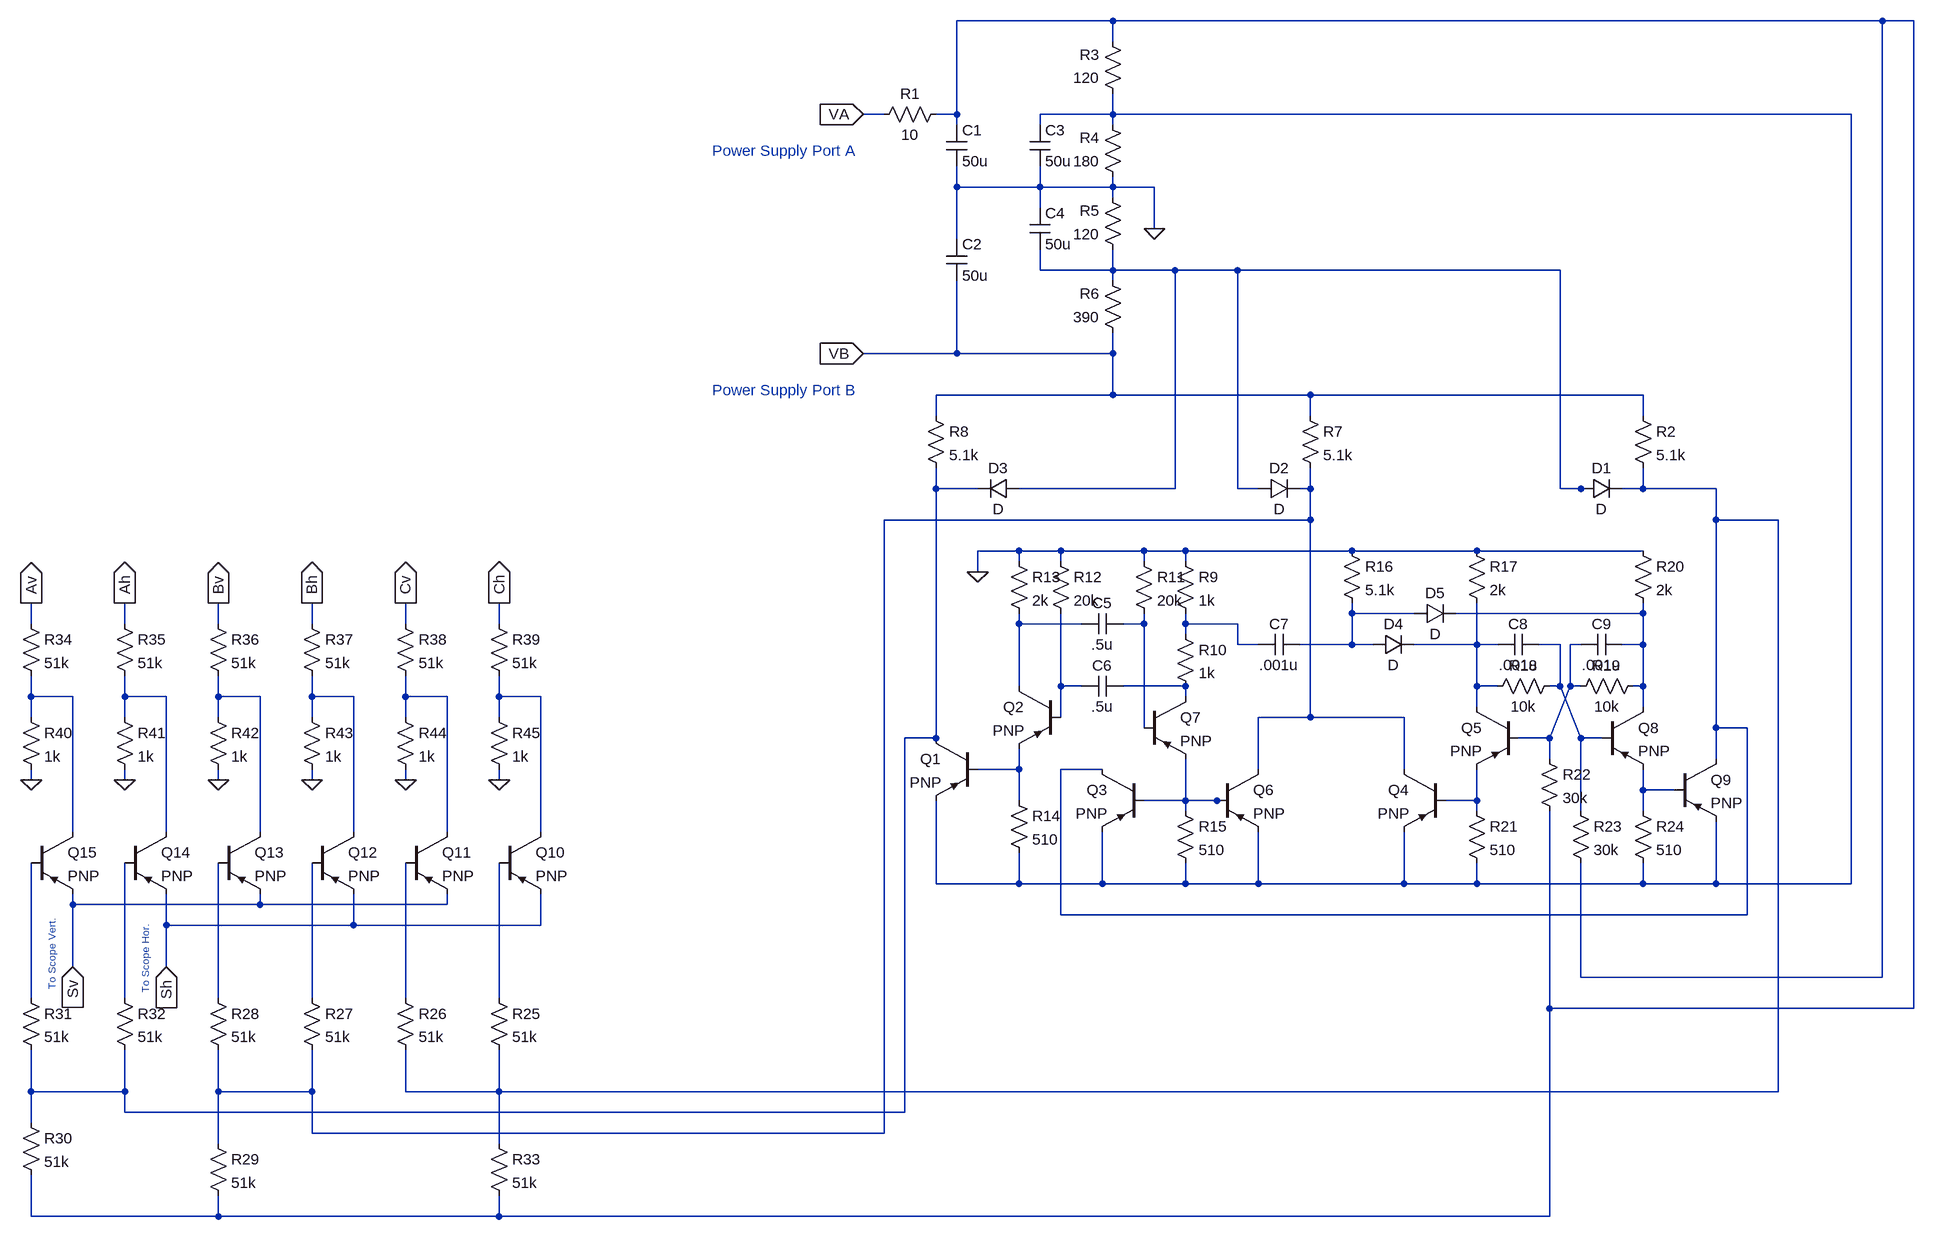
[diagram p0: schematic T42 SwitchCircuit.asc]
T42 SwitchCircuit.asc, the LTspice schematic file:
Version 4
SHEET 1 1700 1368
WIRE 464 -480 224 -480
WIRE 1648 -480 464 -480
WIRE 1696 -480 1648 -480
WIRE 464 -448 464 -480
WIRE 112 -336 80 -336
WIRE 224 -336 224 -480
WIRE 224 -336 192 -336
WIRE 464 -336 464 -368
WIRE 464 -336 352 -336
WIRE 1600 -336 464 -336
WIRE 224 -320 224 -336
WIRE 352 -320 352 -336
WIRE 464 -320 464 -336
WIRE 224 -224 224 -256
WIRE 352 -224 352 -256
WIRE 352 -224 224 -224
WIRE 464 -224 464 -240
WIRE 464 -224 352 -224
WIRE 528 -224 464 -224
WIRE 464 -208 464 -224
WIRE 352 -192 352 -224
WIRE 528 -160 528 -224
WIRE 224 -144 224 -224
WIRE 352 -96 352 -128
WIRE 464 -96 464 -128
WIRE 464 -96 352 -96
WIRE 560 -96 464 -96
WIRE 656 -96 560 -96
WIRE 1152 -96 656 -96
WIRE 464 -80 464 -96
WIRE 224 32 224 -80
WIRE 224 32 80 32
WIRE 464 32 464 0
WIRE 464 32 224 32
WIRE 464 96 464 32
WIRE 464 96 192 96
WIRE 768 96 464 96
WIRE 1280 96 768 96
WIRE 192 128 192 96
WIRE 768 128 768 96
WIRE 1280 128 1280 96
WIRE 192 240 192 208
WIRE 256 240 192 240
WIRE 560 240 560 -96
WIRE 560 240 320 240
WIRE 656 240 656 -96
WIRE 688 240 656 240
WIRE 768 240 768 208
WIRE 768 240 752 240
WIRE 1152 240 1152 -96
WIRE 1184 240 1152 240
WIRE 1200 240 1184 240
WIRE 1280 240 1280 208
WIRE 1280 240 1248 240
WIRE 1392 240 1280 240
WIRE 768 288 768 240
WIRE 768 288 112 288
WIRE 1392 288 1392 240
WIRE 1488 288 1392 288
WIRE 320 336 256 336
WIRE 384 336 320 336
WIRE 512 336 384 336
WIRE 576 336 512 336
WIRE 832 336 576 336
WIRE 1024 336 832 336
WIRE 1280 336 1024 336
WIRE 320 352 320 336
WIRE 384 352 384 336
WIRE 512 352 512 336
WIRE 576 352 576 336
WIRE 256 368 256 336
WIRE 832 432 832 416
WIRE 928 432 832 432
WIRE 1280 432 1280 416
WIRE 1280 432 992 432
WIRE -1200 448 -1200 416
WIRE -1056 448 -1056 416
WIRE -912 448 -912 416
WIRE -768 448 -768 416
WIRE -624 448 -624 416
WIRE -480 448 -480 416
WIRE 320 448 320 432
WIRE 416 448 320 448
WIRE 512 448 512 432
WIRE 512 448 480 448
WIRE 576 448 576 432
WIRE 656 448 576 448
WIRE 576 464 576 448
WIRE 656 480 656 448
WIRE 688 480 656 480
WIRE 832 480 832 432
WIRE 832 480 752 480
WIRE 864 480 832 480
WIRE 1024 480 1024 416
WIRE 1024 480 928 480
WIRE 1056 480 1024 480
WIRE 1152 480 1120 480
WIRE 1184 480 1168 480
WIRE 1280 480 1280 432
WIRE 1280 480 1248 480
WIRE 320 544 320 448
WIRE 384 544 384 432
WIRE 416 544 384 544
WIRE 576 544 480 544
WIRE 1024 544 1024 480
WIRE 1056 544 1024 544
WIRE 1152 544 1152 480
WIRE 1152 544 1136 544
WIRE 1168 544 1168 480
WIRE 1184 544 1168 544
WIRE 1280 544 1280 480
WIRE 1280 544 1264 544
WIRE -1200 560 -1200 528
WIRE -1136 560 -1200 560
WIRE -1056 560 -1056 528
WIRE -992 560 -1056 560
WIRE -912 560 -912 528
WIRE -848 560 -912 560
WIRE -768 560 -768 528
WIRE -704 560 -768 560
WIRE -624 560 -624 528
WIRE -560 560 -624 560
WIRE -480 560 -480 528
WIRE -416 560 -480 560
WIRE 576 560 576 544
WIRE 1024 576 1024 544
WIRE 1280 576 1280 544
WIRE -1200 592 -1200 560
WIRE -1056 592 -1056 560
WIRE -912 592 -912 560
WIRE -768 592 -768 560
WIRE -624 592 -624 560
WIRE -480 592 -480 560
WIRE 384 592 384 544
WIRE 768 592 768 288
WIRE 768 592 688 592
WIRE 912 592 768 592
WIRE 512 608 512 448
WIRE 1392 608 1392 288
WIRE 1440 608 1392 608
WIRE 192 624 192 240
WIRE 192 624 144 624
WIRE 1136 624 1168 544
WIRE 1136 624 1088 624
WIRE 1184 624 1152 544
WIRE 1216 624 1184 624
WIRE 1136 656 1136 624
WIRE 1392 656 1392 608
WIRE 320 672 320 640
WIRE 320 672 256 672
WIRE 448 672 384 672
WIRE 688 672 688 592
WIRE 912 672 912 592
WIRE -1200 688 -1200 672
WIRE -1056 688 -1056 672
WIRE -912 688 -912 672
WIRE -768 688 -768 672
WIRE -624 688 -624 672
WIRE -480 688 -480 672
WIRE 1280 704 1280 672
WIRE 1328 704 1280 704
WIRE 320 720 320 672
WIRE 576 720 576 656
WIRE 576 720 512 720
WIRE 624 720 576 720
WIRE 640 720 624 720
WIRE 1024 720 1024 672
WIRE 1024 720 976 720
WIRE 576 736 576 720
WIRE 1024 736 1024 720
WIRE 1184 736 1184 624
WIRE 1280 736 1280 704
WIRE -1136 768 -1136 560
WIRE -992 768 -992 560
WIRE -848 768 -848 560
WIRE -704 768 -704 560
WIRE -560 768 -560 560
WIRE -416 768 -416 560
WIRE 192 848 192 720
WIRE 320 848 320 800
WIRE 320 848 192 848
WIRE 448 848 448 768
WIRE 448 848 320 848
WIRE 576 848 576 816
WIRE 576 848 448 848
WIRE 688 848 688 768
WIRE 688 848 576 848
WIRE 912 848 912 768
WIRE 912 848 688 848
WIRE 1024 848 1024 816
WIRE 1024 848 912 848
WIRE 1280 848 1280 816
WIRE 1280 848 1024 848
WIRE 1392 848 1392 752
WIRE 1392 848 1280 848
WIRE 1600 848 1600 -336
WIRE 1600 848 1392 848
WIRE -1136 880 -1136 864
WIRE -848 880 -848 864
WIRE -848 880 -1136 880
WIRE -560 880 -560 864
WIRE -560 880 -848 880
WIRE 384 896 384 672
WIRE 1440 896 1440 608
WIRE 1440 896 384 896
WIRE -992 912 -992 864
WIRE -704 912 -704 864
WIRE -704 912 -992 912
WIRE -416 912 -416 864
WIRE -416 912 -704 912
WIRE -1136 976 -1136 880
WIRE -992 976 -992 912
WIRE 1184 992 1184 816
WIRE 1648 992 1648 -480
WIRE 1648 992 1184 992
WIRE -1200 1024 -1200 816
WIRE -1056 1024 -1056 816
WIRE -912 1024 -912 816
WIRE -768 1024 -768 816
WIRE -624 1024 -624 816
WIRE -480 1024 -480 816
WIRE 1136 1040 1136 736
WIRE 1696 1040 1696 -480
WIRE 1696 1040 1136 1040
WIRE -1200 1168 -1200 1104
WIRE -1056 1168 -1056 1104
WIRE -1056 1168 -1200 1168
WIRE -912 1168 -912 1104
WIRE -768 1168 -768 1104
WIRE -768 1168 -912 1168
WIRE -624 1168 -624 1104
WIRE -480 1168 -480 1104
WIRE -480 1168 -624 1168
WIRE 1488 1168 1488 288
WIRE 1488 1168 -480 1168
WIRE -1056 1200 -1056 1168
WIRE 144 1200 144 624
WIRE 144 1200 -1056 1200
WIRE -1200 1216 -1200 1168
WIRE -768 1232 -768 1168
WIRE 112 1232 112 288
WIRE 112 1232 -768 1232
WIRE -912 1248 -912 1168
WIRE -480 1248 -480 1168
WIRE -1200 1360 -1200 1296
WIRE -912 1360 -912 1328
WIRE -912 1360 -1200 1360
WIRE -480 1360 -480 1328
WIRE -480 1360 -912 1360
WIRE 1136 1360 1136 1040
WIRE 1136 1360 -480 1360
FLAG 528 -160 0
FLAG 256 368 0
FLAG -1200 688 0
FLAG -1056 688 0
FLAG -912 688 0
FLAG -768 688 0
FLAG -624 688 0
FLAG -480 688 0
FLAG -1200 416 Av
IOPIN -1200 416 Out
FLAG -1056 416 Ah
IOPIN -1056 416 Out
FLAG -912 416 Bv
IOPIN -912 416 Out
FLAG -768 416 Bh
IOPIN -768 416 Out
FLAG -624 416 Cv
IOPIN -624 416 Out
FLAG -480 416 Ch
IOPIN -480 416 Out
FLAG -1136 976 Sv
IOPIN -1136 976 In
FLAG -992 976 Sh
IOPIN -992 976 In
FLAG 80 -336 VA
IOPIN 80 -336 In
FLAG 80 32 VB
IOPIN 80 32 In
SYMBOL res 208 -352 R90
WINDOW 0 0 56 VBottom 2
WINDOW 3 32 56 VTop 2
SYMATTR InstName R1
SYMATTR Value 10
SYMBOL cap 208 -320 R0
SYMATTR InstName C1
SYMATTR Value 50u
SYMBOL cap 208 -144 R0
SYMATTR InstName C2
SYMATTR Value 50u
SYMBOL diode 1184 256 R270
WINDOW 0 32 32 VTop 2
WINDOW 3 0 32 VBottom 2
SYMATTR InstName D1
SYMBOL res 1264 112 R0
SYMATTR InstName R2
SYMATTR Value 5.1k
SYMBOL res 480 -352 R180
WINDOW 0 36 76 Left 2
WINDOW 3 36 40 Left 2
SYMATTR InstName R3
SYMATTR Value 120
SYMBOL res 480 -224 R180
WINDOW 0 36 76 Left 2
WINDOW 3 36 40 Left 2
SYMATTR InstName R4
SYMATTR Value 180
SYMBOL res 480 -112 R180
WINDOW 0 36 76 Left 2
WINDOW 3 36 40 Left 2
SYMATTR InstName R5
SYMATTR Value 120
SYMBOL res 480 16 R180
WINDOW 0 36 76 Left 2
WINDOW 3 36 40 Left 2
SYMATTR InstName R6
SYMATTR Value 390
SYMBOL cap 336 -320 R0
SYMATTR InstName C3
SYMATTR Value 50u
SYMBOL cap 336 -192 R0
SYMATTR InstName C4
SYMATTR Value 50u
SYMBOL res 752 112 R0
SYMATTR InstName R7
SYMATTR Value 5.1k
SYMBOL diode 688 256 R270
WINDOW 0 32 32 VTop 2
WINDOW 3 0 32 VBottom 2
SYMATTR InstName D2
SYMBOL diode 320 224 R90
WINDOW 0 0 32 VBottom 2
WINDOW 3 32 32 VTop 2
SYMATTR InstName D3
SYMBOL res 176 112 R0
SYMATTR InstName R8
SYMATTR Value 5.1k
SYMBOL pnp 256 624 M0
SYMATTR InstName Q1
SYMBOL pnp 384 544 M0
SYMATTR InstName Q2
SYMBOL pnp 512 672 M0
SYMATTR InstName Q3
SYMBOL pnp 976 672 M0
SYMATTR InstName Q4
SYMBOL pnp 1088 576 M0
SYMATTR InstName Q5
SYMBOL res 560 336 R0
SYMATTR InstName R9
SYMATTR Value 1k
SYMBOL res 560 448 R0
SYMATTR InstName R10
SYMATTR Value 1k
SYMBOL res 496 336 R0
SYMATTR InstName R11
SYMATTR Value 20k
SYMBOL res 368 336 R0
SYMATTR InstName R12
SYMATTR Value 20k
SYMBOL res 304 336 R0
SYMATTR InstName R13
SYMATTR Value 2k
SYMBOL res 304 704 R0
SYMATTR InstName R14
SYMATTR Value 510
SYMBOL res 560 720 R0
SYMATTR InstName R15
SYMATTR Value 510
SYMBOL cap 480 432 R90
WINDOW 0 0 32 VBottom 2
WINDOW 3 32 32 VTop 2
SYMATTR InstName C5
SYMATTR Value .5u
SYMBOL cap 480 528 R90
WINDOW 0 0 32 VBottom 2
WINDOW 3 32 32 VTop 2
SYMATTR InstName C6
SYMATTR Value .5u
SYMBOL cap 752 464 R90
WINDOW 0 0 32 VBottom 2
WINDOW 3 32 32 VTop 2
SYMATTR InstName C7
SYMATTR Value .001u
SYMBOL diode 864 496 R270
WINDOW 0 32 32 VTop 2
WINDOW 3 0 32 VBottom 2
SYMATTR InstName D4
SYMBOL diode 928 448 R270
WINDOW 0 32 32 VTop 2
WINDOW 3 0 32 VBottom 2
SYMATTR InstName D5
SYMBOL res 816 320 R0
SYMATTR InstName R16
SYMATTR Value 5.1k
SYMBOL res 1008 320 R0
SYMATTR InstName R17
SYMATTR Value 2k
SYMBOL cap 1120 464 R90
WINDOW 0 0 32 VBottom 2
WINDOW 3 32 32 VTop 2
SYMATTR InstName C8
SYMATTR Value .001u
SYMBOL cap 1248 464 R90
WINDOW 0 0 32 VBottom 2
WINDOW 3 32 32 VTop 2
SYMATTR InstName C9
SYMATTR Value .001u
SYMBOL res 1152 528 R90
WINDOW 0 0 56 VBottom 2
WINDOW 3 32 56 VTop 2
SYMATTR InstName R18
SYMATTR Value 10k
SYMBOL res 1280 528 R90
WINDOW 0 0 56 VBottom 2
WINDOW 3 32 56 VTop 2
SYMATTR InstName R19
SYMATTR Value 10k
SYMBOL res 1264 320 R0
SYMATTR InstName R20
SYMATTR Value 2k
SYMBOL pnp 624 672 R0
SYMATTR InstName Q6
SYMBOL pnp 512 560 R0
SYMATTR InstName Q7
SYMBOL res 1008 720 R0
SYMATTR InstName R21
SYMATTR Value 510
SYMBOL res 1120 640 R0
SYMATTR InstName R22
SYMATTR Value 30k
SYMBOL res 1168 720 R0
SYMATTR InstName R23
SYMATTR Value 30k
SYMBOL pnp 1216 576 R0
SYMATTR InstName Q8
SYMBOL res 1264 720 R0
SYMATTR InstName R24
SYMATTR Value 510
SYMBOL pnp 1328 656 R0
SYMATTR InstName Q9
SYMBOL res -496 1008 R0
SYMATTR InstName R25
SYMATTR Value 51k
SYMBOL res -640 1008 R0
SYMATTR InstName R26
SYMATTR Value 51k
SYMBOL pnp -480 768 R0
SYMATTR InstName Q10
SYMBOL pnp -624 768 R0
SYMATTR InstName Q11
SYMBOL pnp -768 768 R0
SYMATTR InstName Q12
SYMBOL res -784 1008 R0
SYMATTR InstName R27
SYMATTR Value 51k
SYMBOL pnp -912 768 R0
SYMATTR InstName Q13
SYMBOL res -928 1008 R0
SYMATTR InstName R28
SYMATTR Value 51k
SYMBOL pnp -1056 768 R0
SYMATTR InstName Q14
SYMBOL pnp -1200 768 R0
SYMATTR InstName Q15
SYMBOL res -1216 1200 R0
SYMATTR InstName R30
SYMATTR Value 51k
SYMBOL res -1072 1008 R0
SYMATTR InstName R32
SYMATTR Value 51k
SYMBOL res -1216 1008 R0
SYMATTR InstName R31
SYMATTR Value 51k
SYMBOL res -496 1232 R0
SYMATTR InstName R33
SYMATTR Value 51k
SYMBOL res -928 1232 R0
SYMATTR InstName R29
SYMATTR Value 51k
SYMBOL res -1216 432 R0
SYMATTR InstName R34
SYMATTR Value 51k
SYMBOL res -1072 432 R0
SYMATTR InstName R35
SYMATTR Value 51k
SYMBOL res -928 432 R0
SYMATTR InstName R36
SYMATTR Value 51k
SYMBOL res -784 432 R0
SYMATTR InstName R37
SYMATTR Value 51k
SYMBOL res -640 432 R0
SYMATTR InstName R38
SYMATTR Value 51k
SYMBOL res -496 432 R0
SYMATTR InstName R39
SYMATTR Value 51k
SYMBOL res -1216 576 R0
SYMATTR InstName R40
SYMATTR Value 1k
SYMBOL res -1072 576 R0
SYMATTR InstName R41
SYMATTR Value 1k
SYMBOL res -928 576 R0
SYMATTR InstName R42
SYMATTR Value 1k
SYMBOL res -784 576 R0
SYMATTR InstName R43
SYMATTR Value 1k
SYMBOL res -640 576 R0
SYMATTR InstName R44
SYMATTR Value 1k
SYMBOL res -496 576 R0
SYMATTR InstName R45
SYMATTR Value 1k
TEXT -1168 904 VRight 1 ;To Scope Vert.
TEXT -1024 912 VRight 1 ;To Scope Hor.
TEXT -152 -280 Left 2 ;Power Supply Port A
TEXT -152 88 Left 2 ;Power Supply Port B

The netlist it stands for:
* T42 SwitchCircuit.asc
R1 N001 VA 10
C1 N001 0 50u
C2 0 VB 50u
D1 N003 N006 D
R2 VB N006 5.1k
R3 N002 N001 120
R4 0 N002 180
R5 N003 0 120
R6 VB N003 390
C3 N002 0 50u
C4 0 N003 50u
R7 VB N005 5.1k
D2 N003 N005 D
D3 N003 N004 D
R8 VB N004 5.1k
Q1 N004 N023 N002 0 PNP
Q2 N009 N015 N023 0 PNP
Q3 N006 N025 N002 0 PNP
Q4 N005 N026 N002 0 PNP
Q5 N012 N014 N026 0 PNP
R9 0 N011 1k
R10 N011 N016 1k
R11 0 N010 20k
R12 0 N015 20k
R13 0 N009 2k
R14 N023 N002 510
R15 N025 N002 510
C5 N010 N009 .5u
C6 N016 N015 .5u
C7 N007 N011 .001u
D4 N007 N012 D
D5 N007 N008 D
R16 0 N007 5.1k
R17 0 N012 2k
C8 N013 N012 .001u
C9 N008 N014 .001u
R18 N013 N012 10k
R19 N008 N014 10k
R20 0 N008 2k
Q6 N005 N025 N002 0 PNP
Q7 N016 N010 N025 0 PNP
R21 N026 N002 510
R22 N014 N001 30k
R23 N013 N001 30k
Q8 N008 N013 N024 0 PNP
R24 N024 N002 510
Q9 N006 N024 N002 0 PNP
R25 N032 N006 51k
R26 N031 N006 51k
Q10 N022 N032 Sh 0 PNP
Q11 N021 N031 Sv 0 PNP
Q12 N020 N030 Sh 0 PNP
R27 N030 N005 51k
Q13 N019 N029 Sv 0 PNP
R28 N029 N005 51k
Q14 N018 N028 Sh 0 PNP
Q15 N017 N027 Sv 0 PNP
R30 N004 N001 51k
R32 N028 N004 51k
R31 N027 N004 51k
R33 N006 N001 51k
R29 N005 N001 51k
R34 Av N017 51k
R35 Ah N018 51k
R36 Bv N019 51k
R37 Bh N020 51k
R38 Cv N021 51k
R39 Ch N022 51k
R40 N017 0 1k
R41 N018 0 1k
R42 N019 0 1k
R43 N020 0 1k
R44 N021 0 1k
R45 N022 0 1k
.model D D
.lib standard.dio
.model NPN NPN
.model PNP PNP
.lib standard.bjt
* To Scope Vert.
* To Scope Hor.
* Power Supply Port A
* Power Supply Port B
.backanno
.end